# EAGLE schematic CC2530-CP2102-USB-V02-006 (EAGLE 9.2.2)
MAPLE-CUx Large Version
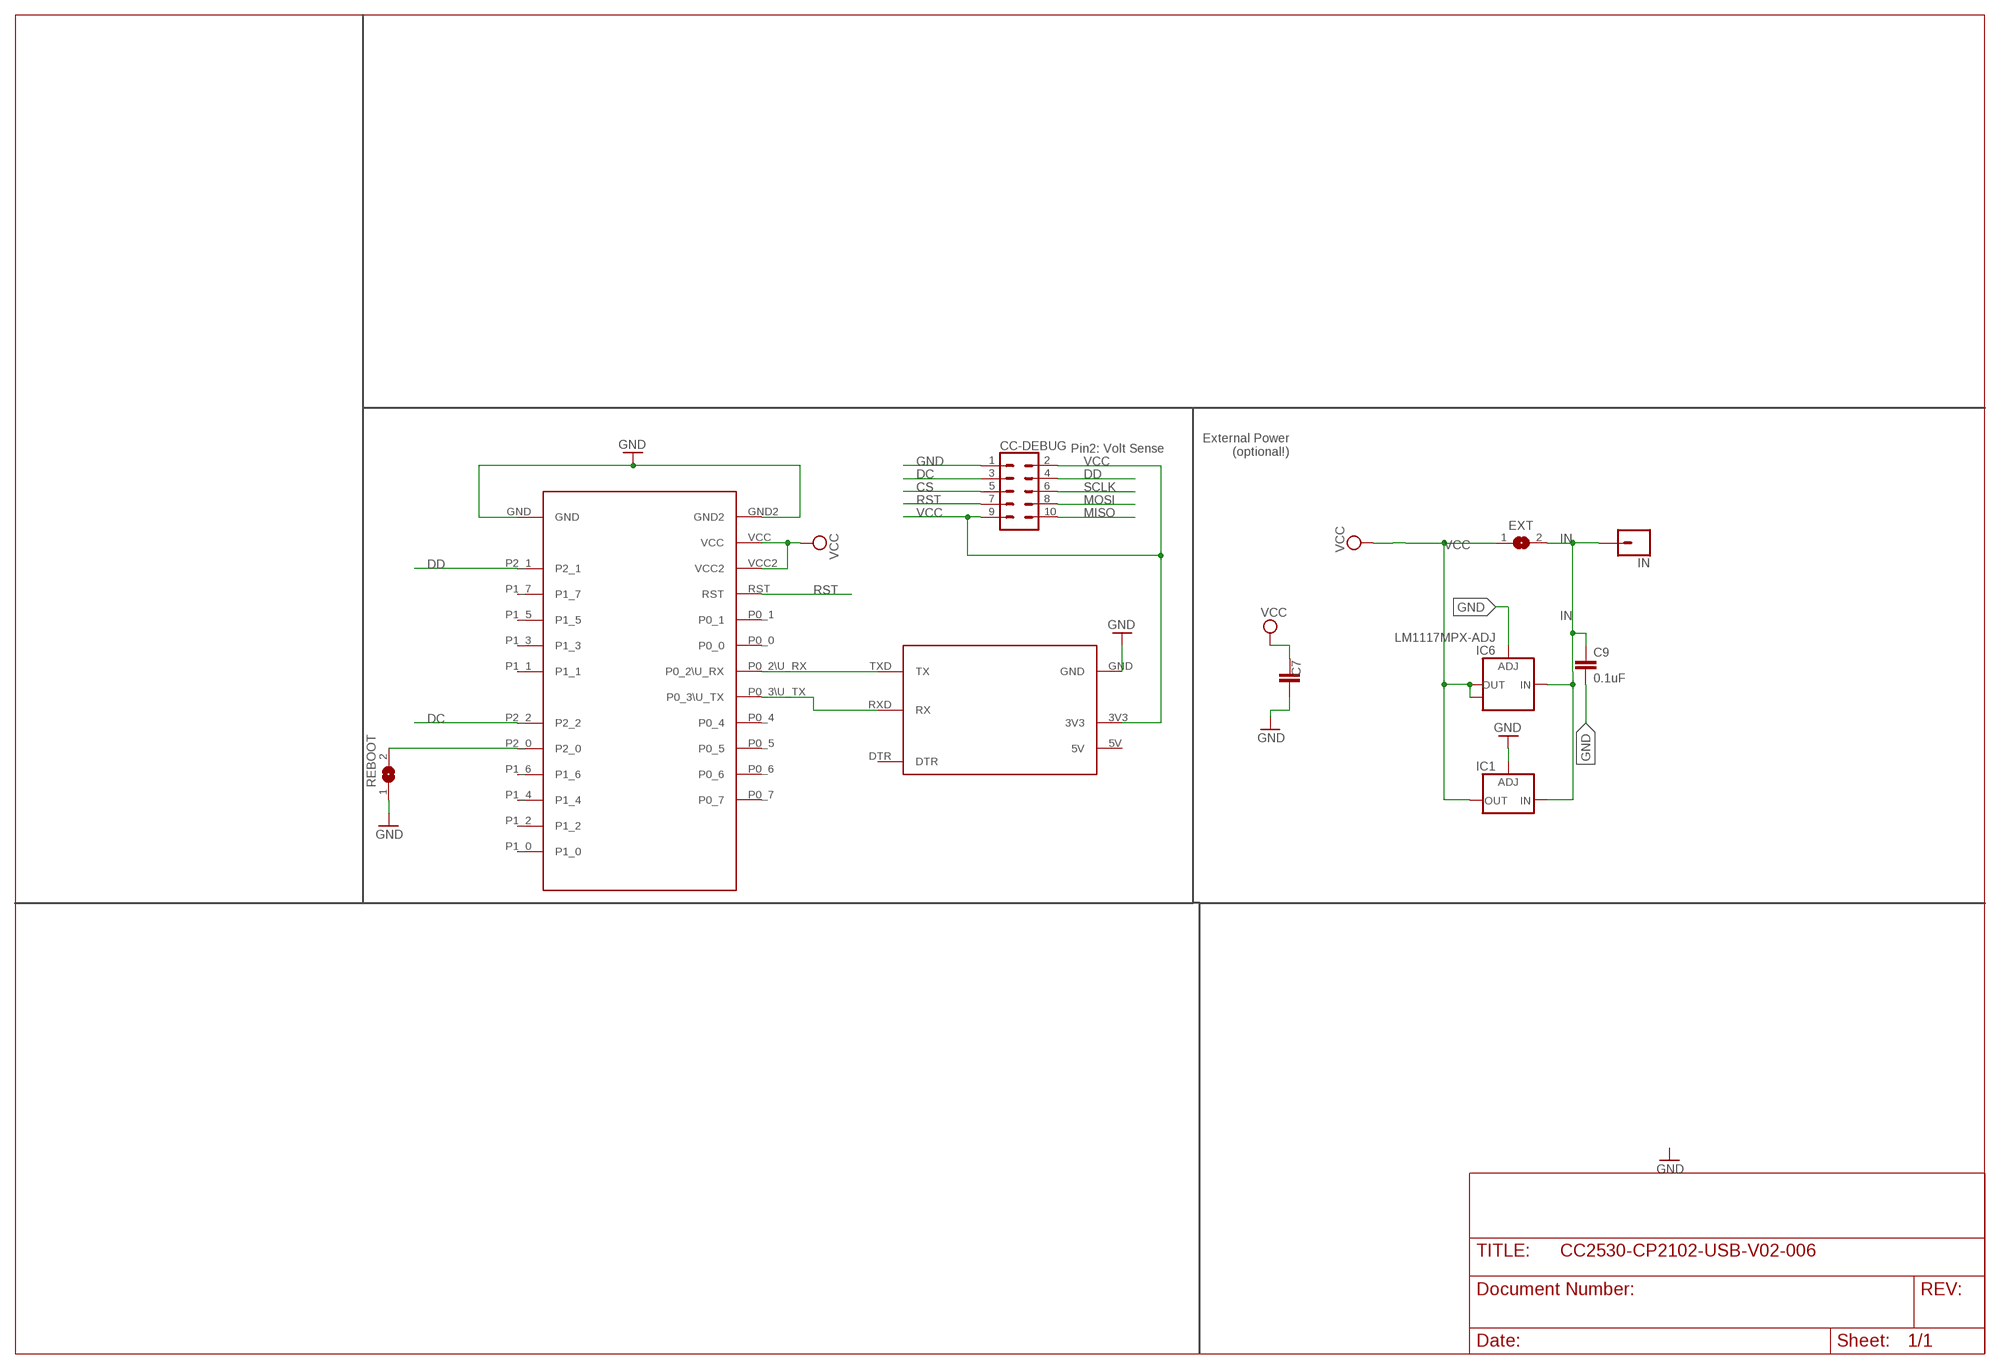
[diagram p0: schematic, sheet 1]

## Parts
C7  C-EUC1812  [C1812]
C9  0.1uF  C-EUC1206  [C1206]
CC-DEBUG  CONN_05X2SHD_LOCK  [2X5-SHROUDED_LOCK]
EXT  SJ  [SJ]
IC1  LD117ADT50TR  [DPACK]
IC6  LM1117MPX-ADJ  [SOT223]
IN  CONN_01  [1X01]
REBOOT  SJ  [SJ]
U$1  CP2101  [CP2101-BEAKOUT]
U$3  CC2530_MODULE  [CC2530_DIL]

## Nets
CS: CC-DEBUG.5
DC: CC-DEBUG.3 U$3.P2_2
DD: CC-DEBUG.4 U$3.P2_1
GND [PWR]: C7.1 C9.2 CC-DEBUG.1 IC1.1(ADJ) IC6.1(ADJ) REBOOT.1 U$1.GND U$3.GND U$3.GND2
IN [PWR]: C9.1 EXT.2 IC1.3(IN) IC6.3(IN) IN.1
MISO: CC-DEBUG.10
MOSI: CC-DEBUG.8
N$1: REBOOT.2 U$3.P2_0
N$2: U$1.TXD(TX) U$3.P0_2\U_RX
N$3: U$1.RXD(RX) U$3.P0_3\U_TX
RST: CC-DEBUG.7 U$3.RST
SCLK: CC-DEBUG.6
VCC [PWR]: C7.2 CC-DEBUG.2 CC-DEBUG.9 EXT.1 IC1.4(OUT) IC6.2(OUT) IC6.TAB(OUT1) U$1.3V3 U$3.VCC U$3.VCC2
Unconnected: U$1.DTR U$3.P0_0 U$3.P0_1 U$3.P0_4 U$3.P0_5 U$3.P0_6 U$3.P0_7 U$3.P1_0 U$3.P1_1 U$3.P1_2 U$3.P1_3 U$3.P1_4 U$3.P1_5 U$3.P1_6 U$3.P1_7

## Notes on the sheet
- External Power
  (optional!)
- Pin2: Volt Sense

## Power pins joined to a net without a drawn wire
5V: U$1.5V

## Library data of the parts
C7 C9 = rcl:C-EU: CAPACITOR, European symbol; SPICEPREFIX: C
CC-DEBUG = SparkFun-Connectors:CONN_05X2: Multi connection point. Often used as Generic Header-pin footprint for 0.1 inch spaced/style header connections For AVR SPI programming port, see special device with nice symbol: "AVR_SPI_PROG_5x2.dev" You can populate with any combo of single row headers, but if you'd like an exact match, check these: 2x5 AVR ICSP Male Header <https://www.sparkfun.com/products/778> (PRT-00778) 2x5 Pin Shrouded Header <https://www.sparkfun.com/products/8506> (PRT-08506) On any of the 0.1 inch spaced packages, you can populate with these: Break Away Headers - Straight <https://www.sparkfun.com/products/116> (PRT-00116) Break Away Male Headers - Right Angle <https://www.sparkfun.com/products/553> (PRT-00553) Female Headers <https://www.sparkfun.com/products/115> (PRT-00115) Break Away Headers - Machine Pin <https://www.sparkfun.com/products/117> (PRT-00117) Break Away Female Headers - Swiss Machine Pin <https://www.sparkfun.com/products/743> (PRT-00743) Special note: the shrouded connector mates well with our 5x2 ribbon cables: 2x5 Pin IDC Ribbon Cable <https://www.sparkfun.com/products/8535> (PRT-08535); PROD_ID: CONN-08671; SF_ID: PRT-08506
EXT REBOOT = jumper:SJ: SMD solder JUMPER
IC1 = v-reg:LD117A?*: Low drop fixed and adjustable positive voltage regulators 1 A Source: http://www.st.com/stonline/products/literature/ds/7194/ld1117axx.pdf
IC6 = lm1117:LM1117MPX-ADJ
IN = SparkFun-Connectors:CONN_01: Single connection point. Often used as Generic Header-pin footprint for 0.1 inch spaced/style header connections On any of the 0.1 inch spaced packages, you can populate with these: Break Away Headers - Straight <https://www.sparkfun.com/products/116> (PRT-00116) Break Away Male Headers - Right Angle <https://www.sparkfun.com/products/553> (PRT-00553) Female Headers <https://www.sparkfun.com/products/115> (PRT-00115) Break Away Headers - Machine Pin <https://www.sparkfun.com/products/117> (PRT-00117) Break Away Female Headers - Swiss Machine Pin <https://www.sparkfun.com/products/743> (PRT-00743) This device is also useful as a general connection point to wire up your design to another part of your project. Our various solder wires solder well into these plated through hole pads. Hook-Up Wire - Assortment (Stranded, 22 AWG) <https://www.sparkfun.com/products/11375> (PRT-11375) Hook-Up Wire - Assortment (Solid Core, 22 AWG) <https://www.sparkfun.com/products/11367> (PRT-11367) View the entire wire category on our website here <https://www.sparkfun.com/categories/141> Special notes: SMTSO-256-ET is a "flush mount" nut for a 4-40 screw. We mostly use this on specialty testbeds; it is a nice way to connect hardware to your PCB at an adjustable hieght. Also note, the SNAP packages are for using a snappable style connector. We sell a baggie of snaps and they are also used on two LilyPad designs: Snap Assortment - 30 pack (male and female) <https://www.sparkfun.com/products/11347> (DEV-11347) LilyPad Arduino SimpleSnap <https://www.sparkfun.com/products/10941> (DEV-10941) LilyPad SimpleSnap Protoboard <https://www.sparkfun.com/products/10940> (DEV-10940)
U$1 = Martin-USB-V001:CP2101
U$3 = Martin-Communication-V4:CC2530_MODULE

## Net classes
0 default: width 0.305 mm
1 PWR: width 0.61 mm